# EAGLE design pcb (EAGLE 9.6.2)
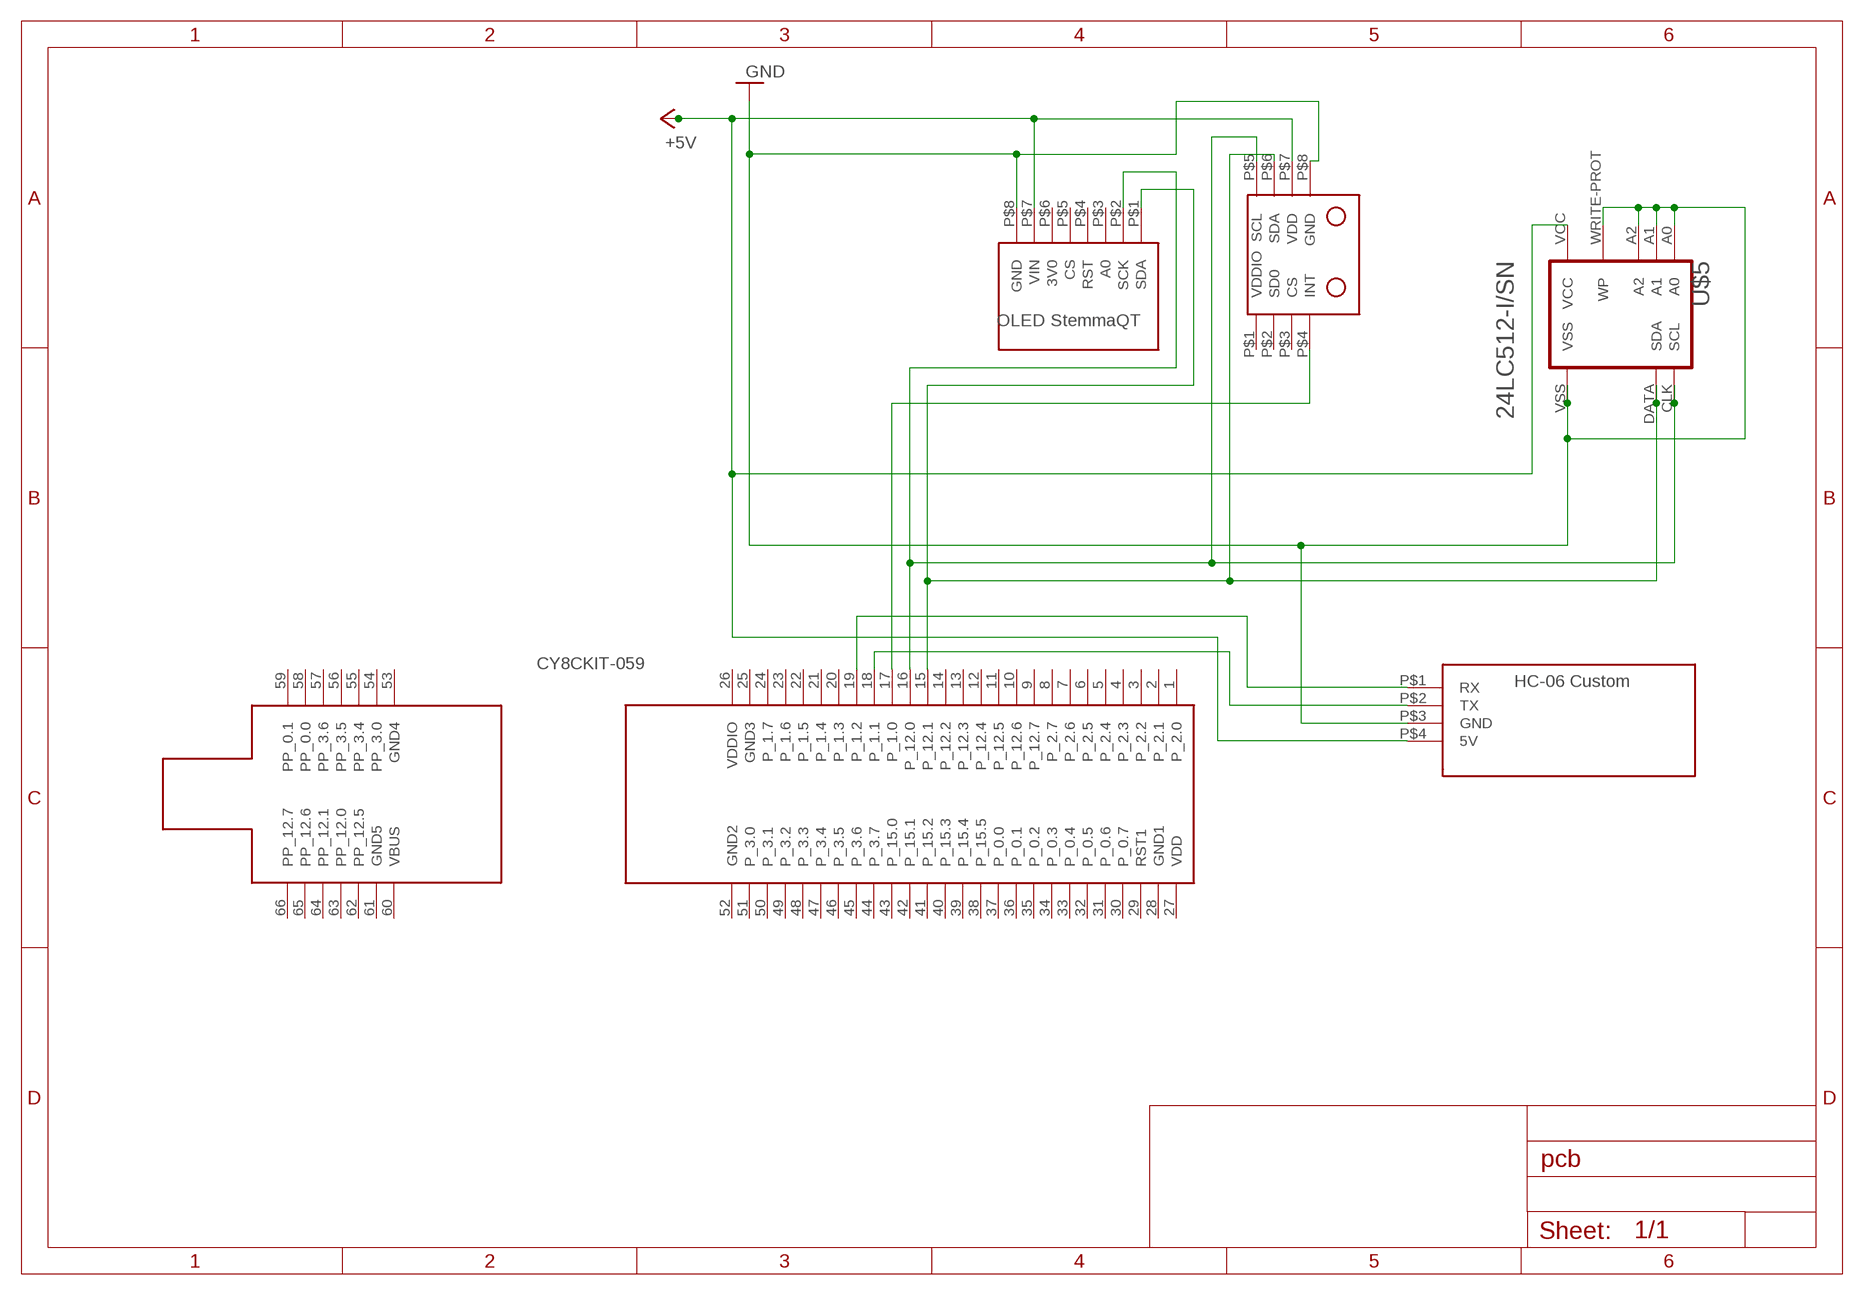
[diagram p0: schematic, sheet 1]

## Parts
U$1  CY8CKIT-059  [CY8CKIT-059]
U$2  SSD1306_STEMMAQT_128X64  [FTP_SSD1306_128X64_4PIN]
U$3  HC-06_CUSTOM  [FTP_HC-06_CUSTOM]
U$4  MPU9250  [FTP_MPU9650]
U$5  24LC512-I-CUSTOM  [24LC512-I-CUSTOM]

## Nets
+5V: U$2.P$7(VIN) U$3.P$4(5V) U$4.P$7(VDD) U$5.VCC
GND: U$2.P$8(GND) U$3.P$3(GND) U$4.P$8(GND) U$5.A0 U$5.A1 U$5.A2 U$5.VSS U$5.WRITE-PROT(WP)
N$1: U$1.19(P_1.2) U$3.P$1(RX)
N$2: U$1.18(P_1.1) U$3.P$2(TX)
N$3: U$1.16(P_12.0) U$2.P$2(SCK) U$4.P$5(SCL) U$5.CLK(SCL)
N$4: U$1.15(P_12.1) U$2.P$1(SDA) U$4.P$6(SDA) U$5.DATA(SDA)
N$5: U$1.17(P_1.0) U$4.P$4(INT)
Unconnected: U$1.1(P_2.0) U$1.2(P_2.1) U$1.3(P_2.2) U$1.4(P_2.3) U$1.5(P_2.4) U$1.6(P_2.5) U$1.7(P_2.6) U$1.8(P_2.7) U$1.9(P_12.7) U$1.10(P_12.6) U$1.11(P_12.5) U$1.12(P_12.4) U$1.13(P_12.3) U$1.14(P_12.2) U$1.20(P_1.3) U$1.21(P_1.4) U$1.22(P_1.5) U$1.23(P_1.6) U$1.24(P_1.7) U$1.25(GND3) U$1.26(VDDIO) U$1.27(VDD) U$1.28(GND1) U$1.29(RST1) U$1.30(P_0.7) U$1.31(P_0.6) U$1.32(P_0.5) U$1.33(P_0.4) U$1.34(P_0.3) U$1.35(P_0.2) U$1.36(P_0.1) U$1.37(P_0.0) U$1.38(P_15.5) U$1.39(P_15.4) U$1.40(P_15.3) U$1.41(P_15.2) U$1.42(P_15.1) U$1.43(P_15.0) U$1.44(P_3.7) U$1.45(P_3.6) U$1.46(P_3.5) U$1.47(P_3.4) U$1.48(P_3.3) U$1.49(P_3.2) U$1.50(P_3.1) U$1.51(P_3.0) U$1.52(GND2) U$1.53(GND4) U$1.54(PP_3.0) U$1.55(PP_3.4) U$1.56(PP_3.5) U$1.57(PP_3.6) U$1.58(PP_0.0) U$1.59(PP_0.1) U$1.60(VBUS) U$1.61(GND5) U$1.62(PP_12.5) U$1.63(PP_12.0) U$1.64(PP_12.1) U$1.65(PP_12.6) U$1.66(PP_12.7) U$2.P$3(A0) U$2.P$4(RST) U$2.P$5(CS) U$2.P$6(3V0) U$4.P$1(VDDIO) U$4.P$2(SD0) U$4.P$3(CS)

## Library data of the parts
U$1 = CY8KIT-059:CY8CKIT-059: Complete CY8CKIT-059 Device This is the complete footprint of the CY8CKIT-059 kit. It offers you the possibility to solder all the pins of the Kit on your PCB.
U$2 = library_GS:SSD1306_STEMMAQT_128X64: Stemma QT 128x64
U$3 = library_GS:HC-06_CUSTOM
U$4 = library_GS:MPU9250: MPU9250 Custom
U$5 = SN:24LC512-I-CUSTOM

## Net classes
0 default: width 1.27 mm

## Board
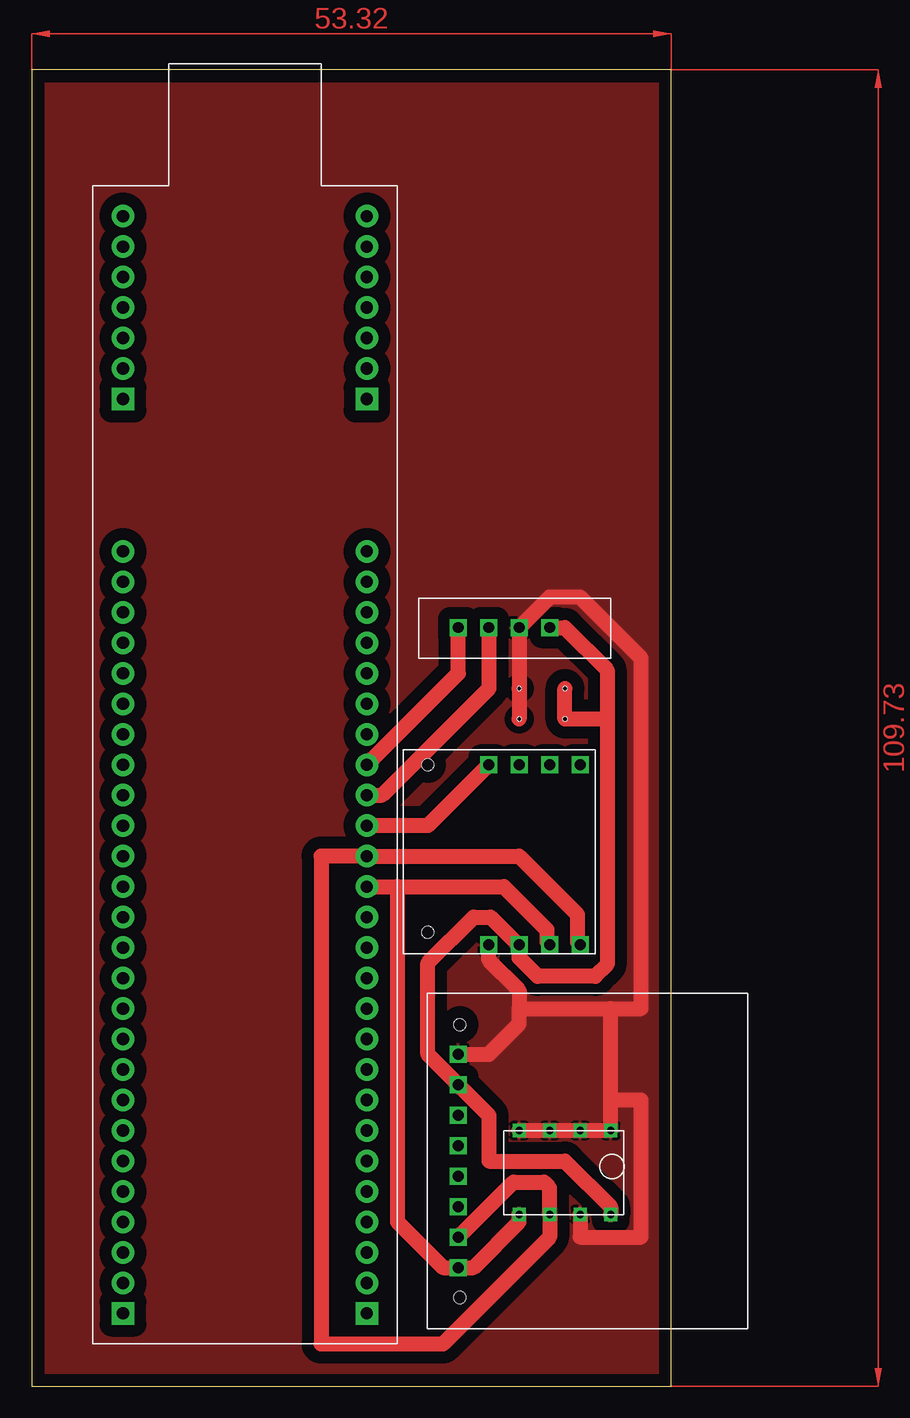
[diagram p1: board, top side]

Size 53.32 x 109.73 mm. Coordinates in mm from the lower left corner, seen from the top.
Outline: 0,109.73 0,0 53.32,0 53.32,109.73 0,109.73
Copper layers (1*16): Top 0.035mm / dielectric 1.5mm / Bottom 0.035mm
Design rules "default": minimum track width 6mil, minimum drill 0.35mm, track to track 6mil, track to pad 6mil, pad to pad 6mil, via to via 6mil, smd to smd 6mil, copper to edge 40mil, drill to drill 6mil, minimum pad ring 10mil, minimum via ring 8mil, stop-mask expansion 4mil, vias tented up to drill 0mil, thermal gap 10mil
Holes 0.35 mm at 44.45,55.61 40.64,55.61 44.45,58.15 40.64,58.15

### Footprints (pad centres in the part's own frame; a part is rotated, then mirrored left to right if it is on the bottom)
CY8CKIT-059 = drill 1.016 pad 1.876 square: 1 30.48,8.89; 27 30.48,-11.43; 53 -45.72,8.89; 60 -45.72,-11.43 | drill 1.016 pad 1.876: 2 27.94,8.89; 3 25.4,8.89; 4 22.86,8.89; 5 20.32,8.89; 6 17.78,8.89; 7 15.24,8.89; 8 12.7,8.89; 9 10.16,8.89; 10 7.62,8.89; 11 5.08,8.89; 12 2.54,8.89; 13 0,8.89; 14 -2.54,8.89; 15 -5.08,8.89; 16 -7.62,8.89; 17 -10.16,8.89; 18 -12.7,8.89; 19 -15.24,8.89; 20 -17.78,8.89; 21 -20.32,8.89; 22 -22.86,8.89; 23 -25.4,8.89; 24 -27.94,8.89; 25 -30.48,8.89; 26 -33.02,8.89; 28 27.94,-11.43; 29 25.4,-11.43; 30 22.86,-11.43; 31 20.32,-11.43; 32 17.78,-11.43; 33 15.24,-11.43; 34 12.7,-11.43; 35 10.16,-11.43; 36 7.62,-11.43; 37 5.08,-11.43; 38 2.54,-11.43; 39 0,-11.43; 40 -2.54,-11.43; 41 -5.08,-11.43; 42 -7.62,-11.43; 43 -10.16,-11.43; 44 -12.7,-11.43; 45 -15.24,-11.43; 46 -17.78,-11.43; 47 -20.32,-11.43; 48 -22.86,-11.43; 49 -25.4,-11.43; 50 -27.94,-11.43; 51 -30.48,-11.43; 52 -33.02,-11.43; 54 -48.26,8.89; 55 -50.8,8.89; 56 -53.34,8.89; 57 -55.88,8.89; 58 -58.42,8.89; 59 -60.96,8.89; 61 -48.26,-11.43; 62 -50.8,-11.43; 63 -53.34,-11.43; 64 -55.88,-11.43; 65 -58.42,-11.43; 66 -60.96,-11.43
FTP_SSD1306_128X64_4PIN = drill 0.9 square: P$1 5.08,24.13; P$2 7.62,24.13; P$3 10.16,24.13; P$4 12.7,24.13; P$5 15.24,24.13; P$6 17.78,24.13; P$7 20.32,24.13; P$8 22.86,24.13 | hole 1: 2.6,24; 25.33,24
FTP_HC-06_CUSTOM = drill 0.9 square: P$1 2.54,12.7; P$2 2.54,10.16; P$3 2.54,7.62; P$4 2.54,5.08
FTP_MPU9650 = drill 0.9 square: P$1 1.27,1.27; P$2 3.81,1.27; P$3 6.35,1.27; P$4 8.89,1.27; P$5 1.27,16.27; P$6 3.81,16.27; P$7 6.35,16.27; P$8 8.89,16.27 | hole 1: 13.97,15.24; 13.97,1.27
24LC512-I-CUSTOM = drill 0.6 square: A0 0,8.89; A1 0,6.35; A2 0,3.81; CLK 7,3.81; DATA 7,1.27; VCC 7,8.89; VSS 0,1.27; WRITE-PROT 7,6.35

### Placement (x,y rotation side)
U$1  19.05,36.56 270 top
U$2  59.69,4.81 90 top
U$3  48.26,60.69 90 top
U$4  46.99,53.07 180 top
U$5  39.37,21.32 270 top

### Tracks (layer width: path | path; a pad name or v marks a point on that pad's centre or on a via)
+5V
  Top 1.27: U$3.P$4 44.45,63.23 47.97,59.71 47.97,55.61 | 47.97,55.61 47.97,35.14 46.99,34.17 42.18,34.17 40.64,35.71 40.64,36.71 | 40.64,36.71 U$4.P$7 | 40.64,36.71 38.25,39.1 36.83,39.1 33.02,35.29 33.02,27.67 U$2.P$7 38.1,22.59 38.1,18.78 44.45,18.78 48.26,14.97 U$5.VCC | 47.97,55.61 44.45,55.61 44.45,58.15
GND
  Top 1.27: U$2.P$8 38.1,27.67 40.64,30.21 40.64,31.48 | U$4.P$8 38.1,35.53 40.64,32.99 40.64,31.48 | 40.64,31.48 48.26,31.48 | 48.26,31.48 50.8,31.48 50.8,60.69 45.72,65.77 43.18,65.77 U$3.P$3 40.64,58.15 40.64,55.61 | 48.26,23.86 U$5.A0 U$5.VSS | 48.26,23.86 48.26,31.48 | U$5.WRITE-PROT 45.72,12.43 50.8,12.43 50.8,23.86 48.26,23.86
  pour Top (isolate 1): 0.55,108.73 52.55,108.73 52.55,0.73 0.55,0.73
N$1
  Top 1.27: U$3.P$1 35.56,59.42 U$1.19
N$2
  Top 1.27: U$3.P$2 38.1,58.15 29.21,49.26 U$1.18
N$3
  Top 1.27: U$4.P$5 45.48,37.04 45.48,39.34 40.64,44.18 U$1.16 24.13,44.18 24.13,3.54 34.29,3.54 43.18,12.43 U$5.CLK 43.18,16.54 42.71,17.01 40.14,17.01 U$2.P$2
N$4
  Top 1.27: U$1.15 30.48,41.64 | 30.48,41.64 39.37,41.64 42.94,38.07 42.94,37.04 U$4.P$6 | U$5.DATA 40.64,13.7 36.83,9.89 U$2.P$1 34.29,9.89 30.48,13.7 30.48,41.64
N$5
  Top 1.27: U$4.P$4 33.02,46.72 U$1.17
(copper drawn outside any net)
  shapes: Top area x2